# Altium schematic sheet BT_Programmer_Shield.SchDoc
size A4
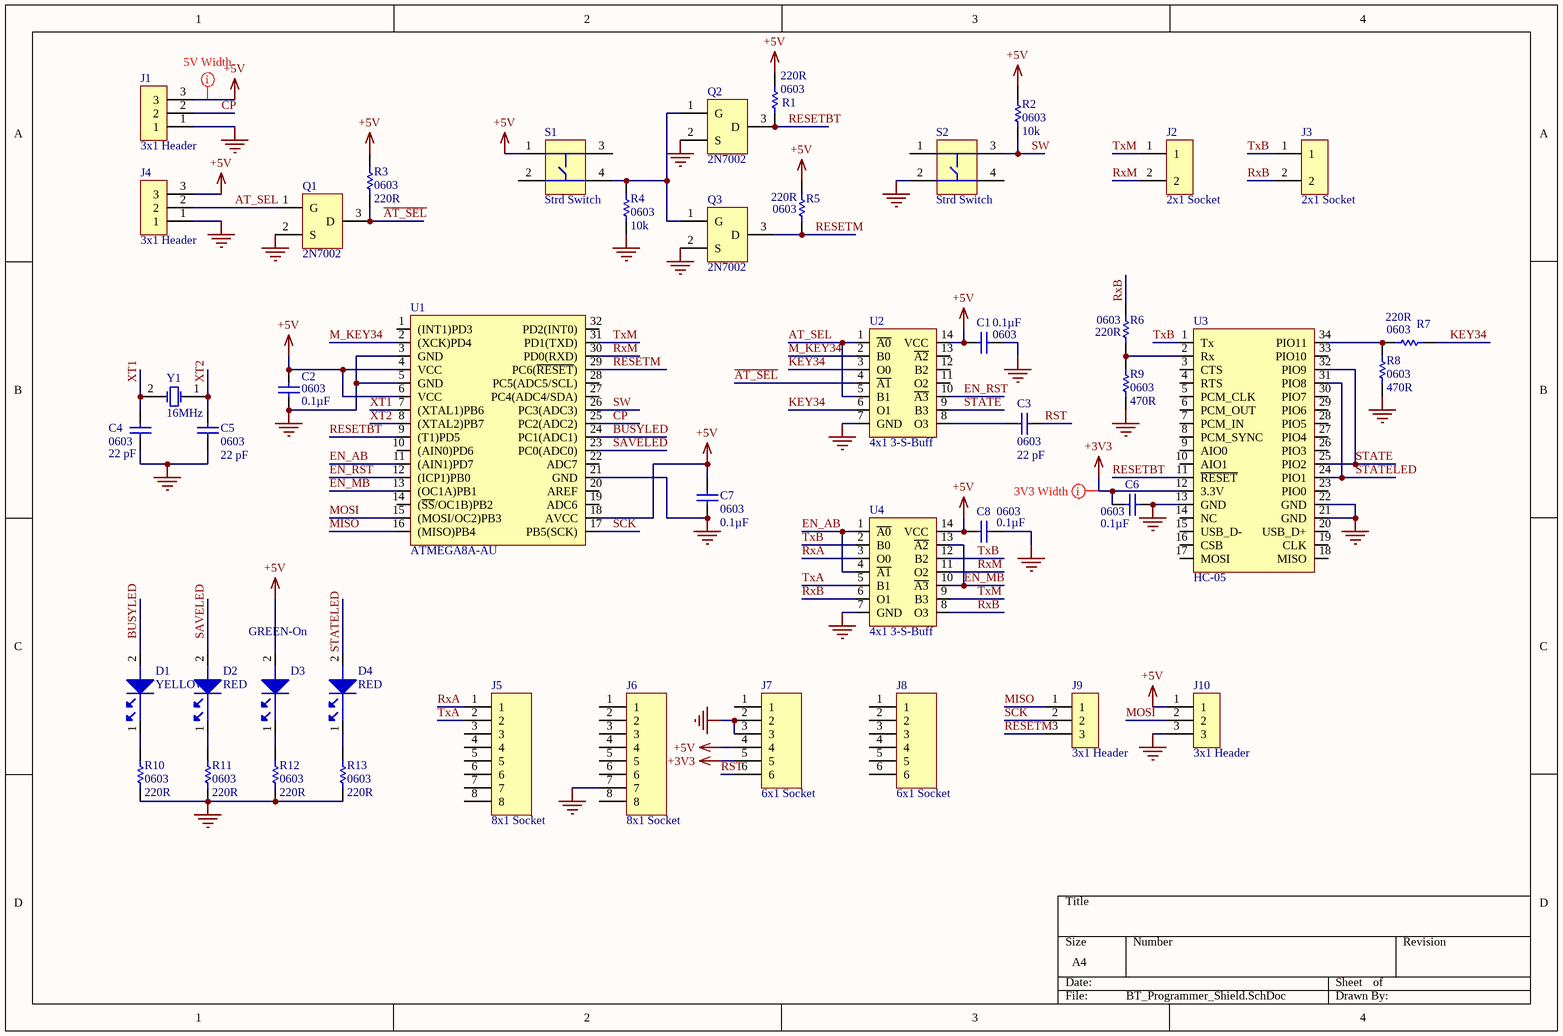
[diagram p0: BT_Programmer_Shield.SchDoc]

## Parts
C1  0603  Capacitance: 0.1µF  [C0603]
C2  0603  Capacitance: 0.1µF  [C0603]
C3  0603  Capacitance: 22 pF  [C0603]
C4  0603  Capacitance: 22 pF  [C0603]
C5  0603  Capacitance: 22 pF  [C0603]
C6  0603  Capacitance: 0.1µF  [C0603]
C7  0603  Capacitance: 0.1µF  [C0603]
C8  0603  Capacitance: 0.1µF  [C0603]
D1  YELLOW  [LED 0603Y]
D2  RED  [LED 0603R]
D3  GREEN-On  [LED 0603G]
D4  RED  [LED 0603R]
J1  3x1 Header  [HDR1X3]
J2  2x1 Socket  [FHDR1X2]
J3  2x1 Socket  [FHDR1X2]
J4  3x1 Header  [HDR1X3]
J5  8x1 Socket  [FHDR1X8]
J6  8x1 Socket  [FHDR1X8]
J7  6x1 Socket  [FHDR1X6]
J8  6x1 Socket  [FHDR1X6]
J9  3x1 Header  [HDR1X3]
J10  3x1 Header  [HDR1X3]
Q1  2N7002  [NMOS SOT523]
Q2  2N7002  [NMOS SOT523]
Q3  2N7002  [NMOS SOT523]
R1  0603  Resistance: 220R  [R0603]
R2  0603  Resistance (Ohms): 10k  [R0603]
R3  0603  Resistance: 220R  [R0603]
R4  0603  Resistance (Ohms): 10k  [R0603]
R5  0603  Resistance: 220R  [R0603]
R6  0603  Resistance: 220R  [R0603]
R7  0603  Resistance: 220R  [R0603]
R8  0603  Resistance: 470R  [R0603]
R9  0603  Resistance: 470R  [R0603]
R10  0603  Resistance: 220R  [R0603]
R11  0603  Resistance: 220R  [R0603]
R12  0603  Resistance: 220R  [R0603]
R13  0603  Resistance: 220R  [R0603]
S1  Strd Switch  [SW DIP2]
S2  Strd Switch  [SW DIP2]
U1  ATMEGA8A-AU  [M8 32L_TQFP_PT]
U2  4x1 3-S-Buff  [BUFF TSSOP-14]
U3  HC-05  [HC-05]
U4  4x1 3-S-Buff  [BUFF TSSOP-14]
Y1  16MHz  [Y HC-49/US]

## Nets
+3V3: C6.1 J7.5 U3.12(3.3V)
+5V: C1.1 C2.2 C7.2 C8.2 D3.2 J1.3 J4.3 J7.4 J10.1 R1.2 R2.2 R3.2 R5.2 S1.1 U1.4(VCC) U1.6(VCC) U1.18(AVCC) U2.14(VCC) U4.14(VCC)
GND: C1.2 C2.1 C4.1 C5.1 C6.2 C7.1 C8.1 J1.1 J4.1 J6.7 J7.2 J7.3 J10.3 Q1.2(S) Q2.2(S) Q3.2(S) R4.2 R8.1 R9.1 R10.1 R11.1 R12.1 R13.1 S2.2 U1.3(GND) U1.5(GND) U1.21(GND) U2.7(GND) U3.13(GND) U3.21(GND) U3.22(GND) U4.7(GND)
~{AT_SEL}: Q1.3(D) R3.1 U2.4(~{A1})
AT_SEL: J4.2 Q1.1(G) U2.1(~{A0}) U2.5(B1)
BUSYLED: D1.2 U1.24(PC1(ADC1))
CP: J1.2 U1.25(PC2(ADC2))
EN_AB: U1.11((AIN1)PD7) U4.1(~{A0}) U4.4(~{A1})
EN_MB: U1.13((OC1A)PB1) U4.10(~{A3}) U4.13(~{A2})
EN_RST: U1.12((ICP1)PB0) U2.10(~{A3})
KEY34: R7.2 U2.3(O0) U2.6(O1)
M_KEY34: U1.2((XCK)PD4) U2.2(B0)
MISO: J9.1 U1.16((MISO)PB4)
MOSI: J10.2 U1.15((MOSI/OC2)PB3)
RESETBT: Q2.3(D) R1.1 U1.9((T1)PD5) U3.11(~{RESET})
RESETM: J9.3 Q3.3(D) R5.1 U1.29(PC6(~{RESET}))
RST: C3.2 J7.6
RxA: J5.1 U4.3(O0)
RxB: J3.2 R6.2 U4.6(O1) U4.8(O3)
RxM: J2.2 U1.30(PD0(RXD)) U4.11(O2)
SAVELED: D2.2 U1.23(PC0(ADC0))
SCK: J9.2 U1.17(PB5(SCK))
STATE: U2.9(B3) U3.25(PIO2) U3.32(PIO9)
STATELED: D4.2 U3.24(PIO1) U3.31(PIO8)
SW: R2.1 S2.3 U1.26(PC3(ADC3))
TxA: J5.2 U4.5(B1)
TxB: J3.1 U3.1(Tx) U4.2(B0) U4.12(B2)
TxM: J2.1 U1.31(PD1(TXD)) U4.9(B3)
XT1: C4.2 U1.7((XTAL1)PB6) Y1.2
XT2: C5.2 U1.8((XTAL2)PB7) Y1.1
NetC3_1: C3.1 U2.8(O3)
NetD1_1: D1.1 R10.2
NetD2_1: D2.1 R11.2
NetD3_1: D3.1 R12.2
NetD4_1: D4.1 R13.2
NetQ2_1: Q2.1(G) Q3.1(G) R4.1 S1.4
NetR6_1: R6.1 R9.2 U3.2(Rx)
NetR7_1: R7.1 R8.2 U3.34(PIO11)

Not connected (* = marked no-connect by the designer): J5 3 4 5 6 7 8; J6 1 2 3 4 5 6 8; J7 1; J8 1 2 3 4 5 6; S1 2 3; S2 1 4; U1 1((INT1)PD3) 10((AIN0)PD6) 14((~{SS}/OC1B)PB2) 19(ADC6) 20(AREF) 22(ADC7) 27(PC4(ADC4/SDA)) 28(PC5(ADC5/SCL)) 32(PD2(INT0)); U2 11(O2) 12(B2) 13(~{A2}); U3 3(CTS) 4(RTS) 5(PCM_CLK) 6(PCM_OUT) 7(PCM_IN) 8(PCM_SYNC) 9(AIO0) 10(AIO1) 14(NC) 15(USB_D-) 16(CSB) 17(MOSI) 18(MISO) 19(CLK) 20(USB_D+) 23(PIO0) 26(PIO3) 27(PIO4) 28(PIO5) 29(PIO6) 30(PIO7) 33(PIO10)

## Layout directives
rule Width Constraint [Pref Width = 20mil    Min Width = 15mil    Max Width = 30mil]: +5V
rule Width Constraint [Pref Width = 25mil    Min Width = 15mil    Max Width = 30mil]: +3V3

## Library data of the parts
C1 C2 C6-C8 = C0603C104M4RACTU: CAP CER 0.1UF 16V X7R 0603; Manufacturer: KEMET; Ceramic Capacitor Case: 0603 [1608 Metric]; Capacitance Tolerance: ± 20%; Product Range: C Series; SVHC: No SVHC (15-Jun-2015); Supplier 1: Digi-Key; Supplier Part Number 1: 399-1099-1-ND; Manufacturer Part Number: C0603C104M4RACTU; Stock 1: 188304; Pricing 1: 1=0.1, 10=0.035, 50=0.0188, 100=0.0154, 500=0.011, 1000=0.0087 (USD); Voltage Rating: 16V; Dielectric Characteristic: X7R; Packaging: Cut Tape; Operating Temperature Min: -55°C; Operating Temperature Max: 125°C; Automotive Qualification Standard: -; MSL: MSL 1 - Unlimited; ComponentLink1URL: https://www.verical.com/server-webapp/html/getDatasheet?partID=66190&src-supplier=Verical; ComponentLink1Description: https://www.verical.com/server-webapp/html/getDatasheet?partID=66190&src-supplier=Verical; ComponentLink2URL: http://www.farnell.com/datasheets/2746055.pdf?src-supplier=Element14; ComponentLink2Description: http://www.farnell.com/datasheets/2746055.pdf?src-supplier=Element14; ComponentLink3URL: http://www.farnell.com/datasheets/2123765.pdf?src-supplier=Element14; ComponentLink3Description: http://www.farnell.com/datasheets/2123765.pdf?src-supplier=Element14; ComponentLink4URL: http://www.alliedelec.com/m/d/9bfe7773041ffe9d406e68bc7b377fdd.pdf?src-supplier=Allied+Electronics; ComponentLink4Description: http://www.alliedelec.com/m/d/9bfe7773041ffe9d406e68bc7b377fdd.pdf?src-supplier=Allied+Electronics; ComponentLink5URL: https://www.verical.com/server-webapp/html/getDatasheet?partID=302288&src-supplier=Verical; ComponentLink5Description: https://www.verical.com/server-webapp/html/getDatasheet?partID=302288&src-supplier=Verical
C3-C5 = C0603C220J1GACTU: CAP CER 22PF 100V C0G/NP0 0603; Manufacturer: KEMET; Part # Aliases: C0603C220J1GAC7867; Tolerance: 5 %; Dielectric: C0G (NP0); Case Height: 0.8 mm; Case Length: 1.6 mm; Class: 1; Dissipation Factor DF: 0.5; Temperature Coefficient / Code: +/- 30 PPM / C; Type: C0G Dielectric, Commercial; Supplier 1: Digi-Key; Supplier Part Number 1: 399-7874-1-ND; Manufacturer Part Number: C0603C220J1GACTU; Stock 1: 518345; Pricing 1: 1=0.1, 10=0.057, 50=0.0312, 100=0.0255, 500=0.0182, 1000=0.0143 (USD); Dimensions: 0.8 mm W x 1.6 mm L x 0.8 mm H; Voltage Rating: 100 V; Product Category: Multilayer Ceramic Capacitors MLCC - SMD/SMT; RoHS: Details; Brand: Kemet; Voltage Rating DC: 100 V; Case Code - in: 0603; Case Code - mm: 1608; Minimum Operating Temperature: - 55 C; Maximum Operating Temperature: + 125 C; Product: General Type MLCCs; Case Width: 0.8 mm; Lead Spacing: 0.7 mm; Operating Temperature Range: - 55 C to + 125 C; Package / Case: 0603 (1608 metric); Packaging: Reel; Series: C0603C; Factory Pack Quantity: 4000; Termination Style: SMD/SMT; ComponentLink1URL: http://www.farnell.com/datasheets/2740975.pdf?src-supplier=Element14; ComponentLink1Description: http://www.farnell.com/datasheets/2740975.pdf?src-supplier=Element14; Category: Capacitors
D1 = LTST-C190YKT: LED YELLOW CLEAR CHIP SMD; Manufacturer: Vishay Lite-On; Chip Material: GaAsP; DELETED: Compliant; Dominant Wave Length: 588 nm; Emitting Color: Amber; Forward Current: 20 mA; Forward Voltage: 2.6 V; High Brightness: No; Lum Intensity: 2.5mcd; Main Category: Chip LED; Number of  Elements: 1; Peak Wavelength: 585 nm; Power Dissipation: 60 W; Product Depth (mm): 1.6 mm; Product Height (mm): 1.1 mm; Product Length (mm): 3.2 mm; Reverse Voltage: 5 V; Shape Type: Rectangular; Test Current (It): 10 mA; Type: Uni-Color; Viewing Angle: 130 deg; Supplier 1: Digi-Key; Supplier Part Number 1: 160-1184-1-ND; Manufacturer Part Number: LTST-C190YKT; Stock 1: 45611; Pricing 1: 1=0.26, 10=0.192, 100=0.0909, 500=0.0606, 1000=0.0475 (USD); Lens Dimensions: 1.1X0.8X0.52 mm; Luminous Intensity: 2.5mcd; Mounting: Surface Mount; Operating Temp Range: -55C to 85C; Operating Temperature Classification: Industrial; Package Type: Chip Led; Packaging: Tape and Reel; Pin Count: 2; Rad Hardened: No; ComponentLink1URL: http://www.mouser.com/ds/2/239/ltstc190yktliteon-194900.pdf?src-supplier=Mouser; ComponentLink1Description: http://www.mouser.com/ds/2/239/ltstc190yktliteon-194900.pdf?src-supplier=Mouser; ComponentLink2URL: https://media.digikey.com/pdf/Data%20Sheets/Lite-On%20PDFs/LTST-C190YKT.pdf?src-supplier=Digi-Key; ComponentLink2Description: https://media.digikey.com/pdf/Data%20Sheets/Lite-On%20PDFs/LTST-C190YKT.pdf?src-supplier=Digi-Key; ComponentLink3URL: https://www.verical.com/server-webapp/html/getDatasheet?partID=242407&src-supplier=Verical; ComponentLink3Description: https://www.verical.com/server-webapp/html/getDatasheet?partID=242407&src-supplier=Verical; Category: Optoelectronics
D2 D4 = LTST-C191KRKT: On a Reel of 5000, 2.4 V Red LED 1608 (0603) SMD, Lite-On LTST-C191KRKT; Manufacturer: Vishay Lite-On; Chip Material: AlGaInP; DELETED: Compliant; Forward Voltage: 2.4 V; Forward Current: 30 mA; Dominant Wave Length: 631 nm; Lum Intensity: 54mcd; High Brightness: Yes; Number of  Elements: 1; Main Category: Chip LED; Power Dissipation: 75 W; Peak Wavelength: 639 nm; Shape Type: Rectangular; Type: Uni-Color; Reverse Voltage: 5 V; Viewing Angle: 130 deg; Test Current (It): 20 mA; Rad Hardened: No; Product Depth (mm): 0.8 mm; Product Height (mm): 0.55 mm; Product Length (mm): 1.6 mm; Supplier 1: Digi-Key; Supplier Part Number 1: 160-1447-1-ND; Manufacturer Part Number: LTST-C191KRKT; Stock 1: 153604; Pricing 1: 1=0.26, 10=0.192, 100=0.0909, 500=0.0606, 1000=0.0475, 2500=0.0465 (USD); Emitting Color: Red; Mounting: Surface Mount; Operating Temp Range: -55C to 85C; Lens Dimensions: 1.1X0.8X0.37 mm; Luminous Intensity: 54mcd; Package Type: Chip Led; Packaging: Tape and Reel; Pin Count: 2; Operating Temperature Classification: Industrial; ComponentLink1URL: http://optoelectronics.liteon.com/upload/download/DS22-2000-223/LTST-C191KRKT.PDF?src-supplier=Digi-Key; ComponentLink1Description: http://optoelectronics.liteon.com/upload/download/DS22-2000-223/LTST-C191KRKT.PDF?src-supplier=Digi-Key; ComponentLink2URL: http://www1.futureelectronics.com/doc/LITE-ON/LTST-C191KRKT.pdf?src-supplier=Future+Electronics; ComponentLink2Description: http://www1.futureelectronics.com/doc/LITE-ON/LTST-C191KRKT.pdf?src-supplier=Future+Electronics; ComponentLink3URL: https://www.verical.com/server-webapp/html/getDatasheet?partID=141922&src-supplier=Verical; ComponentLink3Description: https://www.verical.com/server-webapp/html/getDatasheet?partID=141922&src-supplier=Verical; ComponentLink4URL: http://www.mouser.com/ds/2/239/LTST-C191KRKT-1140668.pdf?src-supplier=Mouser; ComponentLink4Description: http://www.mouser.com/ds/2/239/LTST-C191KRKT-1140668.pdf?src-supplier=Mouser; Category: Optoelectronics
D3 = LTST-C191KGKT: LED Uni-Color Green 574nm 2-Pin Chip LED T/R; Manufacturer: Vishay Lite-On; ECCN (US): EAR99; Number of LEDs: 1; LED Material: AllnGaP; Lens Shape Type: Rectangular; Lens Appearance: Colorless; Mounting Orientation: Top Mount; Intensity: 71mcd(Max); Dominant Wavelength (nm): 576.5(Max); Peak Wavelength (nm): 574; Viewing Angle (°): 130; Maximum Forward Current (mA): 30; Test Current (mA): 20; Maximum Forward Voltage (V): 2.4; Reverse Voltage (V): 5; Maximum Power Dissipation (mW): 75; Lead Standoff: No; High Brightness: Yes; Package Height: 0.55; Package Length: 1.6; Package Width: 0.8; PCB changed: 2; Lead Shape: No Lead; Supplier 1: Digi-Key; Supplier Part Number 1: 160-1446-1-ND; Manufacturer Part Number: LTST-C191KGKT; Stock 1: 745051; Pricing 1: 1=0.26, 10=0.192, 100=0.0909, 500=0.0606, 1000=0.0475, 2500=0.0465 (USD); Part Status: Active; HTS: 8541.40.20.00; Type: Uni-Color; Product Category: Chip LED; Color: Green; Minimum Operating Temperature (°C): -55; Maximum Operating Temperature (°C): 85; Supplier Color: Green; High Power: No; Packaging: Tape and Reel; Supplier Package: Chip LED; Standard Package Name: Chip LED; Pin Count: 2; Mounting: Surface Mount; ComponentLink1URL: http://optoelectronics.liteon.com/upload/download/DS22-2000-228/LTST-C191KGKT.PDF?src-supplier=Digi-Key; ComponentLink1Description: http://optoelectronics.liteon.com/upload/download/DS22-2000-228/LTST-C191KGKT.PDF?src-supplier=Digi-Key; Category: Optoelectronics
J1 J4 J9 J10 = 3-644456-3: CONN HEADER VERT 3POS 2.54MM; Manufacturer: TE Connectivity; Catalog Drawings: 64 Series Strt Post Header; Featured Product: MTA Connectors; 3D Model: 3-644456-3.pdf; Connector Type: Header, Unshrouded; Number of Positions: 3; Number of Positions Loaded: All; Pitch: 0.100" (2.54mm); Dynamic Catalog: MTA-100 Series; Mating Products: 3-644872-3-ND / - CONN RCPT 3POS 24AWG .100 WHITE / 3-644514-3-ND / - CONN RCPT 3POS 28AWG .100 GREEN / 3-644513-3-ND / - CONN RCPT 3POS 26AWG .100 BLUE / 3-644512-3-ND / - CONN RCPT 3POS 24AWG .100 WHITE / 3-641314-3-ND / - CONN RCPT 3POS 28AWG .100 GREEN / 3-641313-3-ND / - CONN RCPT 3POS 26AWG .100 BLUE / 3-641311-3-ND / - CONN RCPT 3POS 22AWG .100 RED / 3-640471-3-ND / - CONN RCPT 3POS 28AWG .100 GREEN / 3-640470-3-ND / - CONN RCPT 3POS 26AWG .100 BLUE / 3-640469-3-ND / - CONN RCPT 3POS 24AWG .100 WHITE / More.; Other Names: 3-644456-3-ND / A31113; Supplier 1: Digi-Key; Supplier Part Number 1: A31113-ND; Manufacturer Part Number: 3-644456-3; Stock 1: 6505; Pricing 1: 1=0.27, 10=0.26, 100=0.1817, 500=0.1558, 1000=0.1298, 5000=0.1113, 10000=0.1038 (USD); RoHS Information: 3-644456-3 Statement of Compliance; Standard Package: 15,000; Category: Connectors; Family: Rectangular Connectors - Headers, Male Pins; Series: MTA-100; Contact Type: Male Pin; Number of Rows: 1; Contact Mating Length: 0.295" (7.49mm); Mounting Type: Through Hole; Termination: Solder; Contact Finish: Tin; Contact Finish Thickness: 150µin (3.81µm); Color: Natural; Packaging: Bulk; ComponentLink1URL: https://www.te.com/commerce/DocumentDelivery/DDEController?Action=srchrtrv&DocNm=644456&DocType=Customer+Drawing&DocLang=English&src-supplier=Digi-Key; ComponentLink1Description: https://www.te.com/commerce/DocumentDelivery/DDEController?Action=srchrtrv&DocNm=644456&DocType=Customer+Drawing&DocLang=English&src-supplier=Digi-Key; ComponentLink2URL: https://www.alliedelec.com/m/d/fdd166ad3a7836eb9c030d72aa4949d7.pdf?src-supplier=Allied+Electronics; ComponentLink2Description: https://www.alliedelec.com/m/d/fdd166ad3a7836eb9c030d72aa4949d7.pdf?src-supplier=Allied+Electronics; ComponentLink3URL: https://www.verical.com/server-webapp/html/getDatasheet?partID=36881&src-supplier=Verical; ComponentLink3Description: https://www.verical.com/server-webapp/html/getDatasheet?partID=36881&src-supplier=Verical; ComponentLink4URL: http://www.te.com/commerce/DocumentDelivery/DDEController?Action=showdoc&DocId=Data+Sheet%7F82056_MTA%7F0608%7Fpdf%7FEnglish%7FENG_DS_82056_MTA_0608.pdf%7F3-644456-3&src-supplier=Future+Electronics; ComponentLink4Description: http://www.te.com/commerce/DocumentDelivery/DDEController?Action=showdoc&DocId=Data+Sheet%7F82056_MTA%7F0608%7Fpdf%7FEnglish%7FENG_DS_82056_MTA_0608.pdf%7F3-644456-3&src-supplier=Future+Electronics; ComponentLink5URL: http://www.jameco.com/Jameco/Products/ProdDS/1967934.pdf?src-supplier=Jameco; ComponentLink5Description: http://www.jameco.com/Jameco/Products/ProdDS/1967934.pdf?src-supplier=Jameco; ComponentLink6URL: http://www.onlinecomponents.com/productFiles/mf-AMP/8852eng_ds_82056_mta_0608.pdf?src-supplier=Onlinecomponents.com; ComponentLink6Description: http://www.onlinecomponents.com/productFiles/mf-AMP/8852eng_ds_82056_mta_0608.pdf?src-supplier=Onlinecomponents.com
J2 J3 = SSW-102-02-T-S: CONN RCPT 2POS 0.1 TIN PCB; Manufacturer: Samtec; Rad Hard: No; Pitch: 2.54 mm; Number of Contacts: 2; Gender: SKT; Supplier 1: Digi-Key; Supplier Part Number 1: SAM1222-02-ND; Manufacturer Part Number: SSW-102-02-T-S; Stock 1: 628; Pricing 1: 1=0.26, 10=0.247, 25=0.2116, 50=0.18, 100=0.1729, 250=0.1552, 500=0.1482 (USD); Packaging: Bulk; Type: Socket Strip; Number of Rows: 1; Contact Plating: Tin Over Nickel; Termination Method: Solder; Category: Connectors; ComponentLink1URL: http://suddendocs.samtec.com/prints/ssw-s.pdf?src-supplier=Digi-Key; ComponentLink1Description: http://suddendocs.samtec.com/prints/ssw-s.pdf?src-supplier=Digi-Key
J5 J6 = 5-535541-6: CONN RECEPT 8POS .100 VERT GOLD; Manufacturer: TE Connectivity; Catalog Drawings: MOD IV Vertical Mount Low Profile; Featured Product: AMPMODU Connectors; 3D Model: 5-535541-6.pdf; Connector Type: Receptacle; Number of Positions: 8; Number of Positions Loaded: All; Pitch: 0.100" (2.54mm); Dynamic Catalog: AMPMODU Mod IV Series; Mating Products: 826646-8-ND / - CONN HEADER BRKWAY 8POS STR GOLD / 5-146282-8-ND / - CONN HEADER BRKWAY 8POS SGL .100 / 146285-8-ND / - CONN HEADER BRKWAY 8POS SGL .100 / 146281-8-ND / - CONN HEADER BRKWAY 8POS SGL .100 / 104349-6-ND / - CONN HEADER 8POS R/A TIN / A34264-08-ND / - CONN HEADR BRKWAY .100 08POS R/A / A34262-08-ND / - CONN HEADR BRKWAY .100 08POS R/A / A34261-08-ND / - CONN HEADR BRKWAY .100 08POS R/A / A34260-08-ND / - CONN HEADR BRKWAY .100 08POS R/A / A34256-08-ND / - CONN HDR BRKWAY .100 08POS VERT / More...; Other Names: A32921; Supplier 1: Digi-Key; Supplier Part Number 1: A32921-ND; Manufacturer Part Number: 5-535541-6; Stock 1: 1412; Pricing 1: 1=2, 10=1.813, 100=1.554, 500=1.295, 1000=1.11, 5000=0.9842, 10000=0.962 (USD); RoHS Information: 5-535541-6 Statement of Compliance; Standard Package: 28; Category: Connectors; Family: Rectangular Connectors - Headers, Receptacles, Female Sockets; Series: AMPMODU Mod IV; Contact Type: Female Socket; Number of Rows: 1; Mounting Type: Through Hole; Termination: Solder; Contact Finish: Gold; Contact Finish Thickness: 30µin (0.76µm); Color: Black; Packaging: Tube; ComponentLink1URL: https://www.te.com/commerce/DocumentDelivery/DDEController?Action=srchrtrv&DocNm=535541&DocType=Customer+Drawing&DocLang=English&src-supplier=Digi-Key; ComponentLink1Description: https://www.te.com/commerce/DocumentDelivery/DDEController?Action=srchrtrv&DocNm=535541&DocType=Customer+Drawing&DocLang=English&src-supplier=Digi-Key; ComponentLink2URL: http://www.tycoelectronics.com/commerce/DocumentDelivery/DDEController?Action=srchrtrv&DocNm=1307819_SECTION_5&DocType=Catalog+Section&DocLang=English&src-supplier=Element14; ComponentLink2Description: http://www.tycoelectronics.com/commerce/DocumentDelivery/DDEController?Action=srchrtrv&DocNm=1307819_SECTION_5&DocType=Catalog+Section&DocLang=English&src-supplier=Element14; ComponentLink3URL: http://www.onlinecomponents.com/productFiles/mf-AMP/eng_ds_1307819_ampmodu_0811.pdf?src-supplier=Onlinecomponents.com; ComponentLink3Description: http://www.onlinecomponents.com/productFiles/mf-AMP/eng_ds_1307819_ampmodu_0811.pdf?src-supplier=Onlinecomponents.com
J7 J8 = 5-534237-4: Conn Socket Strip SKT 6 POS 2.54mm Solder ST Thru-Hole; Manufacturer: TE Connectivity; Catalog Drawings: MOD IV Vertical Mount; Featured Product: AMPMODU Connectors; Connector Type: Receptacle; Number of Positions: 6; Number of Positions Loaded: All; Pitch: 0.100" (2.54mm); Dynamic Catalog: AMPMODU Mod IV Series; Mating Products: 3-104349-0-ND / - CONN HDR BRKAY 6POS R/A .100 TIN / 5-146285-6-ND / - CONN HEADER BRKWAY 6POS SGL .100 / 5-146280-6-ND / - CONN HEADER BRKWAY 6POS SGL .100 / 3-103336-7-ND / - CONN HEADER .100 6POS VERT GOLD / 146133-4-ND / - CONN HEADER BRKAWAY 6POS TIN / 146129-4-ND / - CONN HEADER BRKAWAY 6POS .100 / 146132-4-ND / - CONN HEADER B/A 6POS SL PCB TIN / 104346-4-ND / - CONN HEADER 6POS VERT PCB TIN / 87348-6-ND / - CONN HEADER .100 6POS VERT TIN / A34265-06-ND / - CONN HEADR BRKWAY .100 06POS R/A / More...; Other Names: A32907; Supplier 1: Digi-Key; Supplier Part Number 1: A32907-ND; Manufacturer Part Number: 5-534237-4; Stock 1: 947; Pricing 1: 1=1.62, 10=1.47, 100=1.26, 500=1.05, 1000=0.9, 5000=0.798, 10000=0.78 (USD); RoHS Information: 5-534237-4 Statement of Compliance; Standard Package: 37; Category: Connectors; Family: Rectangular Connectors - Headers, Receptacles, Female Sockets; Series: AMPMODU Mod IV; Contact Type: Female Socket; Number of Rows: 1; Mounting Type: Through Hole; Termination: Solder; Contact Finish: Gold; Contact Finish Thickness: 30µin (0.76µm); Color: Black; Packaging: Tube; ComponentLink1URL: http://www.te.com/commerce/DocumentDelivery/DDEController?Action=showdoc&DocId=Catalog+Section%7F1307819_SECTION_5%7F0908%7Fpdf%7FEnglish%7FENG_CS_1307819_SECTION_5_0908.pdf%7F5-534237-4&src-supplier=Future+Electronics; ComponentLink1Description: http://www.te.com/commerce/DocumentDelivery/DDEController?Action=showdoc&DocId=Catalog+Section%7F1307819_SECTION_5%7F0908%7Fpdf%7FEnglish%7FENG_CS_1307819_SECTION_5_0908.pdf%7F5-534237-4&src-supplier=Future+Electronics; ComponentLink2URL: https://www.te.com/commerce/DocumentDelivery/DDEController?Action=srchrtrv&DocNm=534237&DocType=Customer+Drawing&DocLang=English&src-supplier=Digi-Key; ComponentLink2Description: https://www.te.com/commerce/DocumentDelivery/DDEController?Action=srchrtrv&DocNm=534237&DocType=Customer+Drawing&DocLang=English&src-supplier=Digi-Key; ComponentLink3URL: http://www.te.com/commerce/DocumentDelivery/DDEController?Action=srchrtrv&DocNm=1307819_AMPMODU&DocType=DS&DocLang=English&s_cid=1046&src-supplier=Avnet; ComponentLink3Description: http://www.te.com/commerce/DocumentDelivery/DDEController?Action=srchrtrv&DocNm=1307819_AMPMODU&DocType=DS&DocLang=English&s_cid=1046&src-supplier=Avnet
Q1-Q3 = 2N7002T-7-F: MOSFET N-Channel 60V 0.115A SOT523; Manufacturer: Diodes; Number of Channels: 1 Channel; Id - Continuous Drain Current: 115 mA; Rds On - Drain-Source Resistance: 4.4 Ohms; Vgs - Gate-Source Voltage: 20 V; Channel Mode: Enhancement; Brand: Diodes Incorporated; Configuration: Single; Forward Transconductance - Min: 0.08 S; Pd - Power Dissipation: 150 mW; Transistor Type: 1 N-Channel; Type: Enhancement Mode Field Effect Transistor; Typical Turn-Off Delay Time: 11 ns; Typical Turn-On Delay Time: 7 ns; Unit Weight: 0.000071 oz; Supplier 1: Digi-Key; Supplier Part Number 1: 2N7002T-FDICT-ND; Manufacturer Part Number: 2N7002T-7-F; Stock 1: 422299; Pricing 1: 1=0.38, 10=0.283, 25=0.2476, 100=0.1343, 500=0.1096, 1000=0.0813 (USD); Product Category: MOSFET; RoHS: True; Technology: Si; Mounting Style: SMD/SMT; Package / Case: SOT-523-3; Transistor Polarity: N-Channel; Vds - Drain-Source Breakdown Voltage: 60 V; Minimum Operating Temperature: - 55 C; Maximum Operating Temperature: + 150 C; Packaging: Reel; Height: 0.75 mm; Length: 1.6 mm; Product: MOSFET Small Signal; Series: 2N7002; Factory Pack Quantity: 3000; Width: 0.8 mm; ComponentLink1URL: http://docs-europe.electrocomponents.com/webdocs/0e49/0900766b80e493a7.pdf?src-supplier=Allied+Electronics; ComponentLink1Description: http://docs-europe.electrocomponents.com/webdocs/0e49/0900766b80e493a7.pdf?src-supplier=Allied+Electronics; ComponentLink2URL: https://www.diodes.com/assets/Datasheets/ds30301.pdf?src-supplier=Digi-Key; ComponentLink2Description: https://www.diodes.com/assets/Datasheets/ds30301.pdf?src-supplier=Digi-Key; ComponentLink3URL: https://www.verical.com/server-webapp/html/getDatasheet?partID=141065&src-supplier=Verical; ComponentLink3Description: https://www.verical.com/server-webapp/html/getDatasheet?partID=141065&src-supplier=Verical; ComponentLink4URL: http://www.diodes.com/datasheets/ds30301.pdf?src-supplier=Avnet; ComponentLink4Description: http://www.diodes.com/datasheets/ds30301.pdf?src-supplier=Avnet; ComponentLink5URL: http://www.farnell.com/datasheets/1915455.pdf?src-supplier=Element14; ComponentLink5Description: http://www.farnell.com/datasheets/1915455.pdf?src-supplier=Element14; ComponentLink6URL: http://www.diodes.com/_files/datasheets/ds30301.pdf?src-supplier=Future+Electronics; ComponentLink6Description: http://www.diodes.com/_files/datasheets/ds30301.pdf?src-supplier=Future+Electronics; ComponentLink7URL: http://www.diodes.com/datasheets/ds30301.pdf?src-supplier=Avnet+Europe; ComponentLink7Description: http://www.diodes.com/datasheets/ds30301.pdf?src-supplier=Avnet+Europe; ComponentLink8URL: http://www.jameco.com/Jameco/Products/ProdDS/1538460.pdf?src-supplier=Jameco; ComponentLink8Description: http://www.jameco.com/Jameco/Products/ProdDS/1538460.pdf?src-supplier=Jameco
R1 R3 R5-R7 R10-R13 = CRGP0603F220R: CRGP 0603 220R 1%; Manufacturer: TE Connectivity; Categories: Resistors; Power (Watts): 0.25W, 1/4W; Temperature Coefficient: ±100ppm/°C; Supplier 1: Digi-Key; Supplier Part Number 1: A130408CT-ND; Manufacturer Part Number: CRGP0603F220R; Stock 1: 49528; Pricing 1: 1=0.14, 10=0.121, 100=0.0473, 1000=0.0198, 2500=0.0182 (USD); Series: CRGP; Packaging: Cut Tape (CT); Part Status: Active; Tolerance: ±1%; Composition: Thick Film; Features: Pulse Withstanding; Operating Temperature: -55°C ~ 155°C; Package / Case: 0603 (1608 Metric); Supplier Device Package: 0603; Size / Dimension: 0.063 L x 0.031 W (1.60mm x 0.80mm); Height - Seated (Max): 0.022 (0.55mm); Number of Terminations: 2; Failure Rate: -; ComponentLink1URL: https://www.te.com/commerce/DocumentDelivery/DDEController?Action=srchrtrv&DocNm=9-1773463-9&DocType=DS&DocLang=English&src-supplier=Digi-Key; ComponentLink1Description: https://www.te.com/commerce/DocumentDelivery/DDEController?Action=srchrtrv&DocNm=9-1773463-9&DocType=DS&DocLang=English&src-supplier=Digi-Key
R2 R4 = ESR03EZPF1002: RES SMD 10K OHM 1% 1/4W 0603; Manufacturer: Rohm; Product Training Modules: Resistor Products Overview; Featured Product: ROHM Chip Resistors; EDA / CAD Models: Download from Accelerated Designs; Power (Watts): 0.25W, 1/4W; Temperature Coefficient: ±100ppm/°C; Online Catalog: ESR03 Series; Other Names: RHM10KADDKR; Supplier 1: Digi-Key; Supplier Part Number 1: RHM10KADCT-ND; Manufacturer Part Number: ESR03EZPF1002; Stock 1: 173014; Pricing 1: 1=0.12, 10=0.11, 100=0.0424, 1000=0.0187, 2500=0.0161 (USD); Standard Package: 1; Category: Resistors; Family: Chip Resistor - Surface Mount; Series: ESR; Packaging: Digi-Reel®; Tolerance: ±1%; Composition: Thick Film; Features: Automotive AEC-Q200, Pulse Withstanding; Operating Temperature: -55°C ~ 155°C; Package / Case: 0603 (1608 Metric); Supplier Device Package: 0603 (1608 Metric); Size / Dimension: 0.063" L x 0.031" W (1.60mm x 0.80mm); Height: 0.022" (0.55mm); Number of Terminations: 2; ComponentLink1URL: https://www.rohm.com/datasheet/ESR01MZPF/esr-e?src-supplier=Digi-Key; ComponentLink1Description: https://www.rohm.com/datasheet/ESR01MZPF/esr-e?src-supplier=Digi-Key
R8 R9 = ESR03EZPJ471: ROHM - ESR03EZPJ471 - SMD Chip Resistor, Anti-Surge, 0603 [1608 Metric], 470 ohm, ESR Series, 150 V, Thick Film, 250 mW; Categories: Resistors; Tolerance: ±5%; Power (Watts): 0.25W, 1/4W; Temperature Coefficient: ±200ppm/°C; Supplier 1: Digi-Key; Supplier Part Number 1: RHM470DCT-ND; Manufacturer: Rohm; Manufacturer Part Number: ESR03EZPJ471; Stock 1: 23164; Pricing 1: 1=0.1, 10=0.079, 100=0.0303, 1000=0.0133, 2500=0.0115 (USD); Series: ESR; Packaging: Tape & Reel (TR); Part Status: Active; Composition: Thick Film; Features: Automotive AEC-Q200, Pulse Withstanding; Operating Temperature: -55°C ~ 155°C; Package / Case: 0603 (1608 Metric); Supplier Device Package: 0603; Size / Dimension: 0.063 L x 0.031 W (1.60mm x 0.80mm); Height - Seated (Max): 0.022 (0.55mm); Number of Terminations: 2; Failure Rate: -; ComponentLink1URL: http://www.farnell.com/datasheets/2611941.pdf?src-supplier=Element14; ComponentLink1Description: http://www.farnell.com/datasheets/2611941.pdf?src-supplier=Element14; ComponentLink2URL: http://www.farnell.com/datasheets/2611941.pdf?src-supplier=Farnell; ComponentLink2Description: http://www.farnell.com/datasheets/2611941.pdf?src-supplier=Farnell; ComponentLink3URL: https://www.rohm.com/datasheet/ESR01MZPF/esr-e?src-supplier=Digi-Key; ComponentLink3Description: https://www.rohm.com/datasheet/ESR01MZPF/esr-e?src-supplier=Digi-Key; ComponentLink4URL: http://www.farnell.com/datasheets/2611941.pdf?src-supplier=Newark; ComponentLink4Description: http://www.farnell.com/datasheets/2611941.pdf?src-supplier=Newark
S1 S2 = 1825910-6: SWITCH TACTILE SPST-NO 0.05A 24V; Manufacturer: TE Connectivity Alcoswitch; Actuator Color: Black; Actuator Length: 1.4 mm; Actuator Material: Polybutylene Terephthalate; Body Orientation: Straight; Actuator Style: Round Button; Bushing Type: Unthreaded; Electrical Life: 100000 Cycles; Dielectric Strength: 500 VAC; Contact Rating @ Voltage: 0.05A@24VDC; Function: Momentary Contact; Pole Throw Configuration: SPST; Maximum Contact Resistance: 100 mOhm; Illumination: N/R; Switch Configuration: OFF (ON); Supplier 1: Digi-Key; Supplier Part Number 1: 450-1650-ND; Manufacturer Part Number: 1825910-6; Stock 1: 104984; Pricing 1: 1=0.1, 10=0.101, 25=0.0956, 100=0.087, 250=0.0818, 500=0.0748, 1000=0.0627, 2500=0.0609, 5000=0.0574 (USD); Base Material: N/A; Family: 1825910; Contact Material: Copper Alloy; Contact Plating: Silver; Dimension: 5.99 x 5 mm; Part No: 1825910-6; RoHS: Yes; Maximum AC Voltage Rating: N/A; Maximum DC Voltage Rating: 24 V; Mechanical Life: 100000 Cycles; Packaging: N/A; Housing Material: N/A; Product Weight: N/A; Mounting: Through Hole; Minimum Insulation Resistance: 100 MOhm; Operating Temperature: -35 to 85 C; Terminal Type: PC Pins; Seal Description: N/A; Seal Location: N/A; Thread Size: N/R; ComponentLink1URL: http://www.onlinecomponents.com/productFiles/mf-AMP/1825910-6rqpn1825910-6.pdf?src-supplier=Onlinecomponents.com; ComponentLink1Description: http://www.onlinecomponents.com/productFiles/mf-AMP/1825910-6rqpn1825910-6.pdf?src-supplier=Onlinecomponents.com; ComponentLink2URL: http://www.te.com/commerce/DocumentDelivery/DDEController?Action=srchrtrv&DocNm=1825910&DocType=Customer+Drawing&DocLang=English&src-supplier=Verical; ComponentLink2Description: http://www.te.com/commerce/DocumentDelivery/DDEController?Action=srchrtrv&DocNm=1825910&DocType=Customer+Drawing&DocLang=English&src-supplier=Verical; Category: Switches
U1 = ATMEGA8A-AU: MCU 8-bit ATmega AVR RISC 8KB Flash 3.3V/5V 32-Pin TQFP; Manufacturer: Microchip; Supplier 1: Digi-Key; Supplier Part Number 1: ATMEGA8A-AU-ND; Manufacturer Part Number: ATMEGA8A-AU; Stock 1: 786; Pricing 1: 1=1.91, 25=1.75, 100=1.59 (USD); Category: Integrated Circuits (ICs)
U2 U4 = MC74ACT125DTR2G: IC BUFF TRI-ST QD N-INV 14TSSOP; Manufacturer: ON Semiconductor; Logic Family: ACT; Logical Function: Buffer/Line Driver; Number of  Elements: 4; Operating Supply Voltage (Typ): 5V; Output Type: 3-State; Polarity: Non-Inverting; Propagation Delay Time: 10.5ns; High Level Output Current: -24mA; Low Level Output Current: 24mA; Operating Supply Voltage (Max): 5.5V; Operating Supply Voltage (Min): 4.5V; Quiescent Current: 8uA; Supplier 1: Digi-Key; Supplier Part Number 1: MC74ACT125DTR2GOSCT-ND; Manufacturer Part Number: MC74ACT125DTR2G; Stock 1: 3201; Pricing 1: 1=0.4, 10=0.342, 25=0.3188, 100=0.2551, 250=0.2369, 500=0.2004, 1000=0.1549 (USD); Number of Channels: 4; Number of Inputs: 4; Number of Outputs: 4; Package Type: TSSOP; Packaging: Tape and Reel; Technology: CMOS; Pin Count: 14; Mounting: Surface Mount; Operating Temp Range: -40C to 85C; Operating Temperature Classification: Industrial; ComponentLink1URL: http://www.onsemi.com/pub_link/Collateral/MC74AC125-D.PDF?src-supplier=Digi-Key; ComponentLink1Description: http://www.onsemi.com/pub_link/Collateral/MC74AC125-D.PDF?src-supplier=Digi-Key; ComponentLink2URL: http://www.onsemi.cn/pub_link/Collateral/MC74AC125-D.PDF?src-supplier=Avnet; ComponentLink2Description: http://www.onsemi.cn/pub_link/Collateral/MC74AC125-D.PDF?src-supplier=Avnet; ComponentLink3URL: http://www.onsemi.cn/pub_link/Collateral/MC74AC125-D.PDF?src-supplier=Avnet+Europe; ComponentLink3Description: http://www.onsemi.cn/pub_link/Collateral/MC74AC125-D.PDF?src-supplier=Avnet+Europe; ComponentLink4URL: https://www.verical.com/server-webapp/html/getDatasheet?partID=148069&src-supplier=Verical; ComponentLink4Description: https://www.verical.com/server-webapp/html/getDatasheet?partID=148069&src-supplier=Verical
U3 = HC-05 V2.0+EDR Bluetooth module
Y1 = ECS-160-20-4X: CRYSTAL 16.0000MHZ 20PF T/H; Manufacturer: ECS International; Brand: ECS; Case Height: 3.5 mm; Case Length: 11.35 mm; Case Width: 4.65 mm; Frequency Stability: 50 PPM; Tolerance: 30 PPM; Supplier 1: Digi-Key; Supplier Part Number 1: X1103-ND; Manufacturer Part Number: ECS-160-20-4X; Stock 1: 5001; Pricing 1: 1=0.69, 10=0.575, 50=0.5176, 100=0.46, 500=0.437, 1000=0.368, 2500=0.345, 5000=0.3335, 10000=0.322 (USD); Dimensions: 4.65 mm W x 11.35 mm L x 3.5 mm H; Factory Pack Quantity: 200; Frequency: 16 MHz; Load Capacitance: 20 pF; Package / Case: HC-49/US; Operating Temperature Range: - 10 C to + 70 C; Packaging: Bulk; Mounting Style: Through Hole; Product Category: Crystals; RoHS: Details; Termination Style: Radial; Series: HCS49USX; Type: Quartz Crystals; ComponentLink1URL: http://www.ecsxtal.com/store/pdf/partnumber4.pdf?src-supplier=Digi-Key; ComponentLink1Description: http://www.ecsxtal.com/store/pdf/partnumber4.pdf?src-supplier=Digi-Key; Category: Crystals